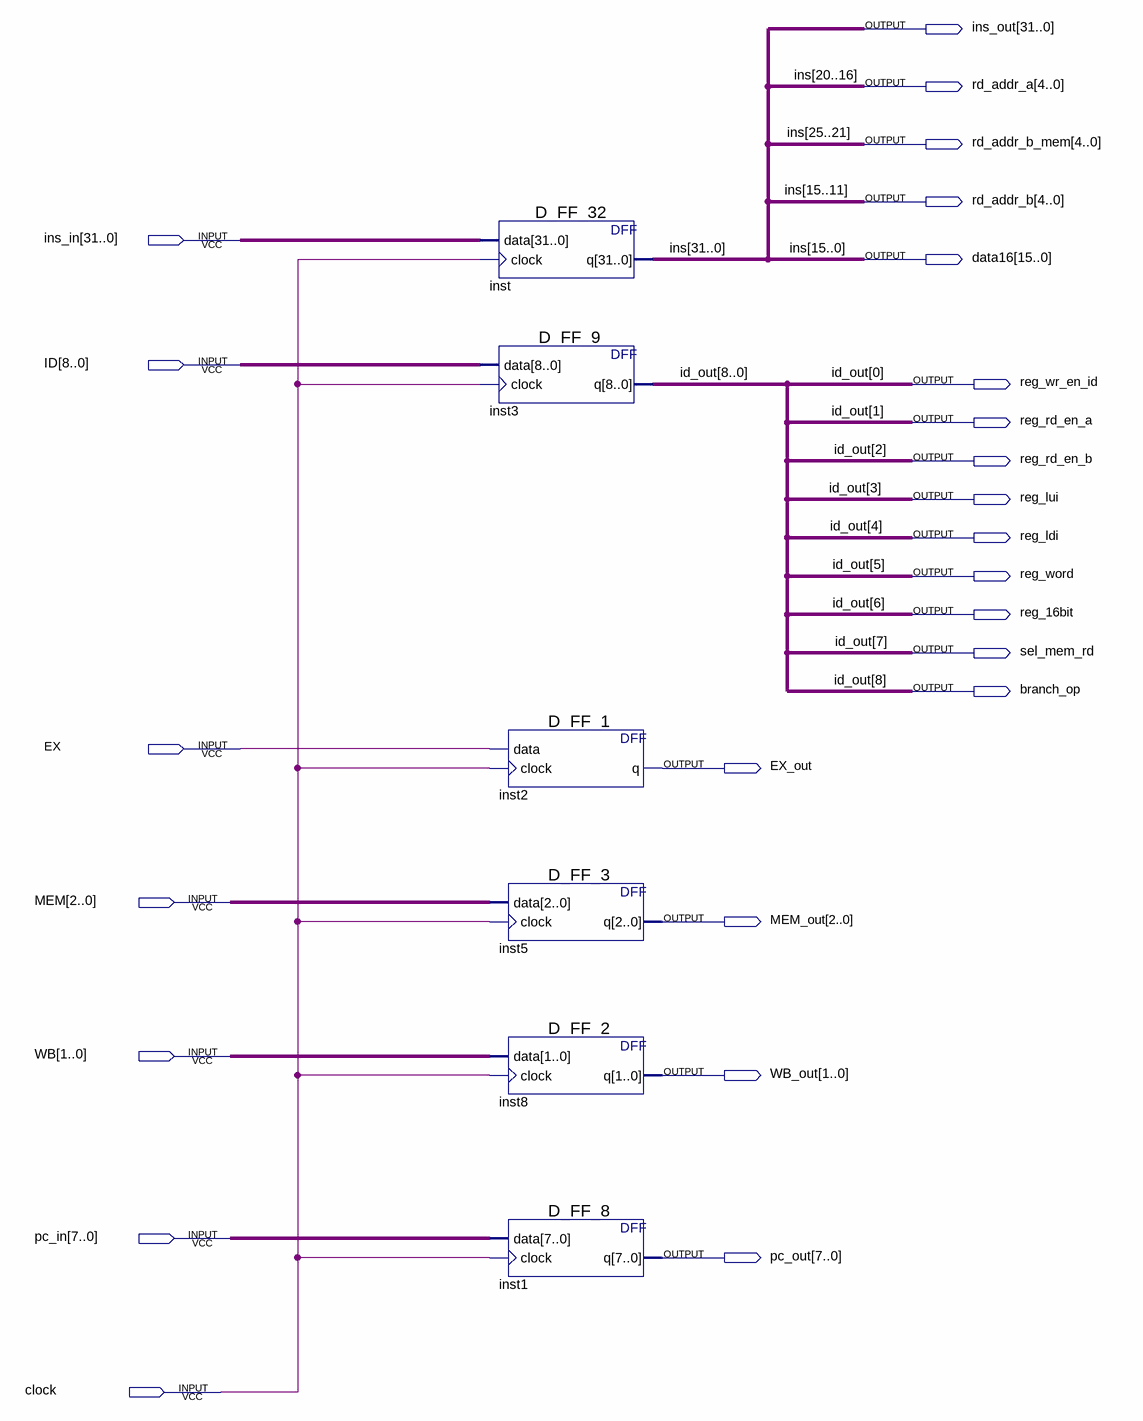
[diagram p0: schematic sheet]
// Quartus schematic IF_ID.bdf as structural Verilog: 6 symbols, 25 pins
module IF_ID (
  input  [31:0] ins_in,
  input  [8:0] ID,
  input  EX,
  input  [2:0] MEM,
  input  [1:0] WB,
  input  [7:0] pc_in,
  input  clock,
  output [31:0] ins_out,
  output [4:0] rd_addr_a,
  output [4:0] rd_addr_b_mem,
  output [4:0] rd_addr_b,
  output [15:0] data16,
  output reg_wr_en_id,
  output reg_rd_en_a,
  output reg_rd_en_b,
  output reg_lui,
  output reg_ldi,
  output reg_word,
  output reg_16bit,
  output sel_mem_rd,
  output branch_op,
  output EX_out,
  output [2:0] MEM_out,
  output [1:0] WB_out,
  output [7:0] pc_out
);

  D_FF_32 inst (.data(ins_in), .clock(clock), .q({ins_out[31:16], data16}));
  D_FF_9 inst3 (
    .data(ID), .clock(clock),
    .q({branch_op, sel_mem_rd, reg_16bit, reg_word, reg_ldi, reg_lui, reg_rd_en_b, reg_rd_en_a, reg_wr_en_id}));
  D_FF_1 inst2 (.data(EX), .clock(clock), .q(EX_out));
  D_FF_3 inst5 (.data(MEM), .clock(clock), .q(MEM_out));
  D_FF_2 inst8 (.data(WB), .clock(clock), .q(WB_out));
  D_FF_8 inst1 (.data(pc_in), .clock(clock), .q(pc_out));

  assign ins_out[15:0] = data16;
  assign rd_addr_a = ins_out[20:16];
  assign rd_addr_b = data16[15:11];
  assign rd_addr_b_mem = ins_out[25:21];

  // Other names for the same wires on the sheet: id_out[8:0] = {branch_op, sel_mem_rd, reg_16bit, reg_word, reg_ldi, reg_lui, reg_rd_en_b, reg_rd_en_a, reg_wr_en_id};
  //   ins[31:0] = {ins_out[31:16], data16}
endmodule
